# EAGLE design MB_DoorLock293 (EAGLE 9.5.2)
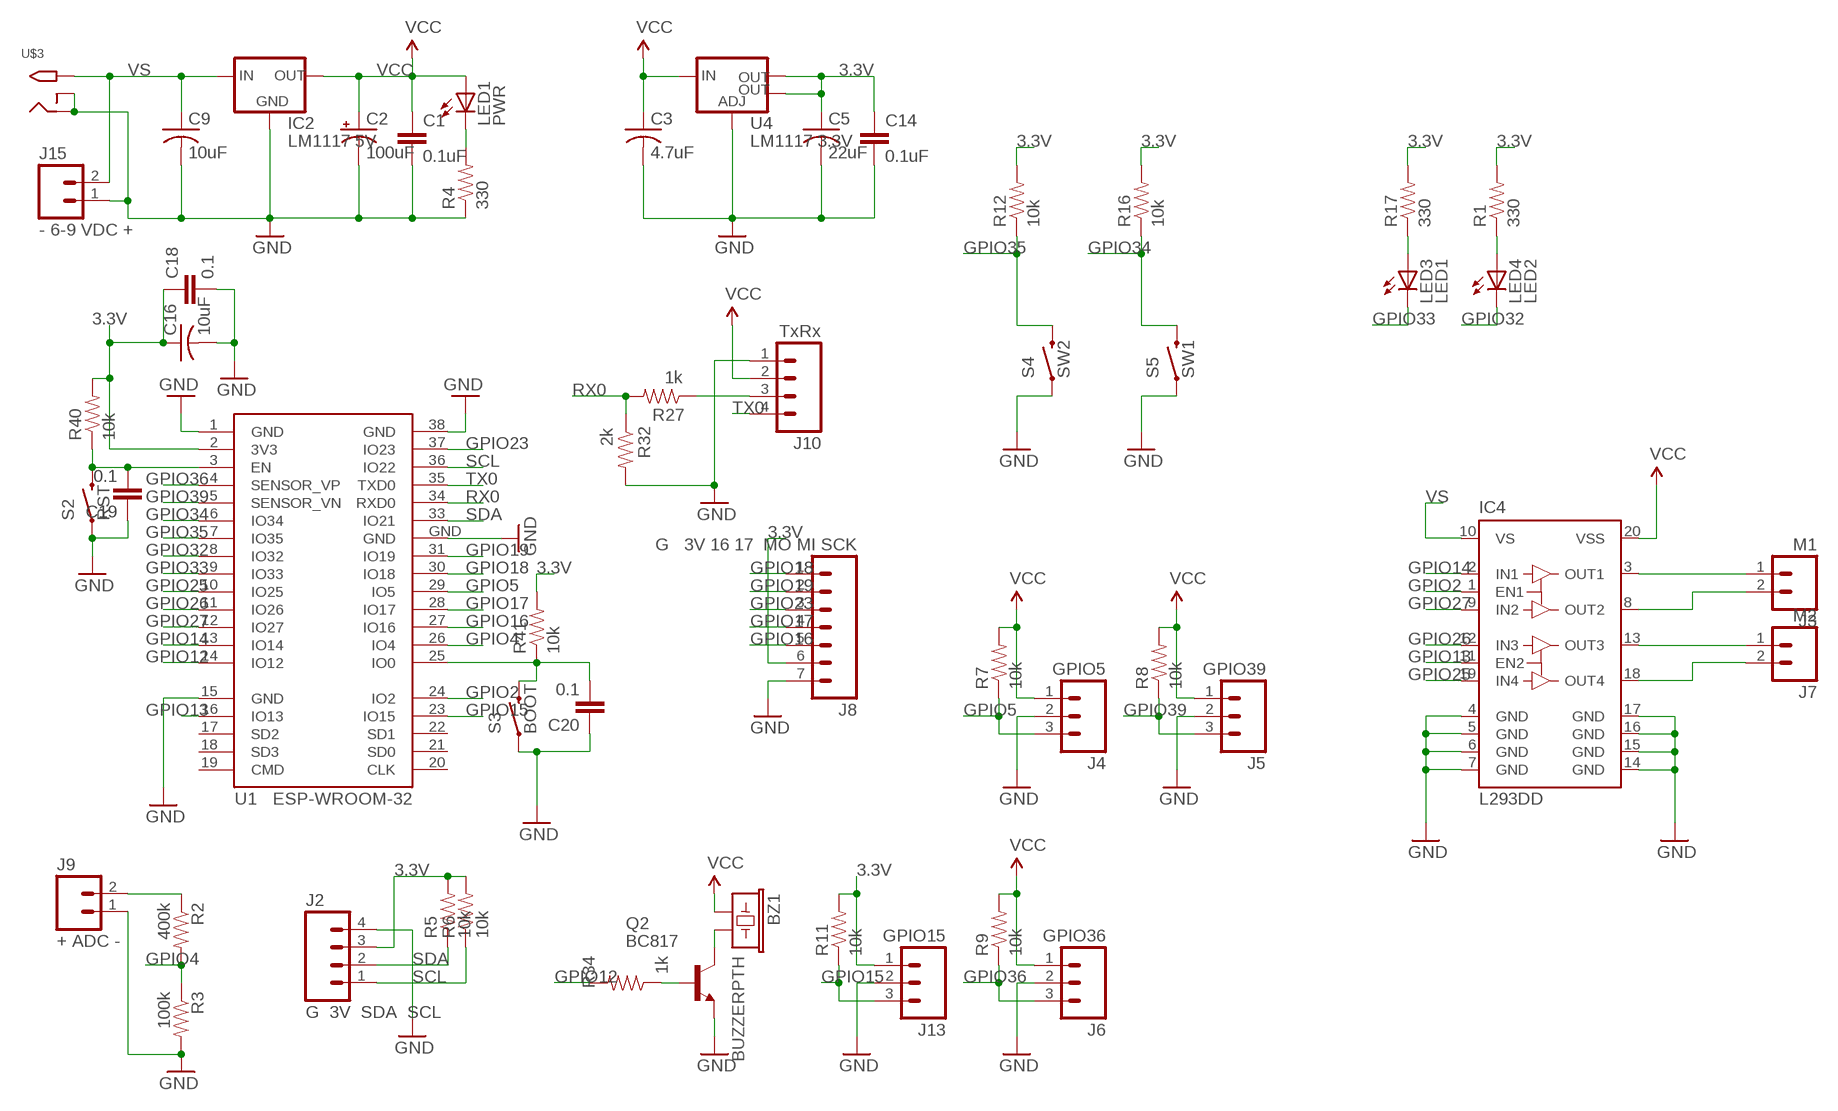
[diagram p0: schematic, sheet 1]

## Parts
BZ1  BUZZERPTH  [BUZZER-12MM]
C1  0.1uF  CAP0805  [0805]
C2  100uF  CAP_POL3528-KIT  [EIA3528-KIT]
C3  4.7uF  C-USC1206  [C1206]
C5  22uF  C-USC1206  [C1206]
C9  10uF  C-USC1206  [C1206]
C14  0.1uF  CAP0805  [0805]
C16  10uF  C-USC1206  [C1206]
C18  0.1  CAP0805  [0805]
C19  0.1  CAP0805  [0805]
C20  0.1  CAP0805  [0805]
IC2  LM1117 5V  LM1117DTX-3.3  [TO252]
IC4  L293DD  [SO20]
J2  G 3V SDA SCL  M04JST-PTH-VERT  [JST-4-PTH-VERT]
J3  M1  M02JST-PTH-VERT  [JST-2-PTH-VERT]
J4  GPIO5  M03JST-PTH-VERT  [JST-3-PTH-VERT]
J5  GPIO39  M03JST-PTH-VERT  [JST-3-PTH-VERT]
J6  GPIO36  M03JST-PTH-VERT  [JST-3-PTH-VERT]
J7  M2  M02JST-PTH-VERT  [JST-2-PTH-VERT]
J8  G 3V 16 17 MO MI SCK  M07  [1X07]
J9  + ADC -  M02JST-PTH-VERT  [JST-2-PTH-VERT]
J10  TxRx  M04POLAR  [MOLEX-1X4]
J13  GPIO15  M03JST-PTH-VERT  [JST-3-PTH-VERT]
J15  - 6-9 VDC +  M02JST-PTH-VERT  [JST-2-PTH-VERT]
LED1  PWR  LEDCHIP-LED0805  [CHIP-LED0805]
LED3  LED1  LEDCHIP-LED0805  [CHIP-LED0805]
LED4  LED2  LEDCHIP-LED0805  [CHIP-LED0805]
Q2  BC817  BC817-40LT1SMD  [SOT23-BEC]
R1  330  RESISTOR0805-RES  [0805]
R2  400k  RESISTOR0805-RES  [0805]
R3  100k  RESISTOR0805-RES  [0805]
R4  330  RESISTOR0805-RES  [0805]
R5  10k  RESISTOR0805-RES  [0805]
R6  10k  RESISTOR0805-RES  [0805]
R7  10k  RESISTOR0805-RES  [0805]
R8  10k  RESISTOR0805-RES  [0805]
R9  10k  RESISTOR0805-RES  [0805]
R11  10k  RESISTOR0805-RES  [0805]
R12  10k  RESISTOR0805-RES  [0805]
R16  10k  RESISTOR0805-RES  [0805]
R17  330  RESISTOR0805-RES  [0805]
R27  1k  RESISTOR0805-RES  [0805]
R32  2k  RESISTOR0805-RES  [0805]
R34  1k  RESISTOR0805-RES  [0805]
R40  10k  RESISTOR0805-RES  [0805]
R41  10k  RESISTOR0805-RES  [0805]
S2  RST  SWITCH-MOMENTARY-2SMD-1101NE  [TACTILE-SWITCH-1101NE]
S3  BOOT  SWITCH-MOMENTARY-2SMD-1101NE  [TACTILE-SWITCH-1101NE]
S4  SW2  SWITCH-MOMENTARY-2SMD-1101NE  [TACTILE-SWITCH-1101NE]
S5  SW1  SWITCH-MOMENTARY-2SMD-1101NE  [TACTILE-SWITCH-1101NE]
U1  ESP-WROOM-32  [ESP-WROOM-32]
U4  LM1117 3.3V  V_REG_LM1117SOT223  [SOT223]
U$3  7*12V  2.1MMJACK  [PJ-102A]

## Nets
3.3V: C5.1 C14.1 C16.1 C18.1 J2.3 J8.6 J13.1 R1.2 R5.2 R6.2 R11.2 R12.2 R16.2 R17.2 R40.2 R41.2 U1.2(3V3) U4.2(OUT) U4.4(OUT)
GND: C1.2 C2.C(-) C3.2 C5.2 C9.2 C14.2 C16.2 C18.2 C19.1 C20.1 IC2.1(GND) IC4.4(GND) IC4.5(GND) IC4.6(GND) IC4.7(GND) IC4.14(GND) IC4.15(GND) IC4.16(GND) IC4.17(GND) J2.4 J4.2 J5.2 J6.2 J8.7 J9.1 J10.1 J13.2 J15.1 Q2.E R3.2 R4.1 R32.2 S2.1 S3.1 S4.1 S5.1 U1.1(GND) U1.15(GND) U1.38(GND) U1.GND U4.1(ADJ) U$3.RING U$3.RING_SW
GPIO2: IC4.1(EN1) U1.24(IO2)
GPIO4: R2.2 R3.1 U1.26(IO4)
GPIO5: J4.3 R7.1 U1.29(IO5)
GPIO12: R34.2 U1.14(IO12)
GPIO13: IC4.11(EN2) U1.16(IO13)
GPIO14: IC4.2(IN1) U1.13(IO14)
GPIO15: J13.3 R11.1 U1.23(IO15)
GPIO16: J8.5 U1.27(IO16)
GPIO17: J8.4 U1.28(IO17)
GPIO18: J8.1 U1.30(IO18)
GPIO19: J8.2 U1.31(IO19)
GPIO23: J8.3 U1.37(IO23)
GPIO25: IC4.19(IN4) U1.10(IO25)
GPIO26: IC4.12(IN3) U1.11(IO26)
GPIO27: IC4.9(IN2) U1.12(IO27)
GPIO32: LED4.C U1.8(IO32)
GPIO33: LED3.C U1.9(IO33)
GPIO34: R16.1 S5.2 U1.6(IO34)
GPIO35: R12.1 S4.2 U1.7(IO35)
GPIO36: J6.3 R9.1 U1.4(SENSOR_VP)
GPIO39: J5.3 R8.1 U1.5(SENSOR_VN)
N$1: IC4.3(OUT1) J3.1
N$2: IC4.13(OUT3) J7.1
N$3: J9.2 R2.1
N$4: J10.3 R27.1
N$5: LED3.A R17.1
N$6: C20.2 R41.1 S3.2 U1.25(IO0)
N$9: LED1.C R4.2
N$11: LED4.A R1.1
N$14: IC4.8(OUT2) J3.2
N$16: C19.2 R40.1 S2.2 U1.3(EN)
N$17: IC4.18(OUT4) J7.2
N$29: Q2.B R34.1
N$40: BZ1.- Q2.C
RX0: R27.2 R32.1 U1.34(RXD0)
SCL: J2.1 R6.1 U1.36(IO22)
SDA: J2.2 R5.1 U1.33(IO21)
TX0: J10.4 U1.35(TXD0)
VCC: BZ1.+ C1.1 C2.A(+) C3.1 IC2.TAB(OUT) IC4.20(VSS) J4.1 J5.1 J6.1 J10.2 LED1.A R7.2 R8.2 R9.2 U4.3(IN)
VS: C9.1 IC2.2(IN) IC4.10(VS) J15.2 U$3.TIP
Unconnected: U1.17(SD2) U1.18(SD3) U1.19(CMD) U1.20(CLK) U1.21(SD0) U1.22(SD1)

## Library data of the parts
BZ1 = SparkFun-Electromechanical:BUZZER: Buzzer 12mm Spark Fun Electronics SKU : Comp-Buzzer
C1 C14 C18-C20 = SparkFun-Passives:CAP: Capacitor Standard 0603 ceramic capacitor, and 0.1" leaded capacitor.
C2 = SparkFun-Passives:CAP_POL: Capacitor Polarized These are standard SMD and PTH capacitors. Normally 10uF, 47uF, and 100uF in electrolytic and tantalum varieties. Always verify the external diameter of the through hole cap, it varies with capacity, voltage, and manufacturer. The EIA devices should be standard.
C3 C5 C9 C16 = adafruit:C-US: CAPACITOR, American symbol
IC2 = lm1117:LM1117DTX-*
IC4 = st-microelectronics:L293DD: PUSH-PULL FOUR CHANNEL DRIVER WITH DIODES Source: http://www.st.com/stonline/books/pdf/docs/1330.pdf; OC_FARNELL: unknown
J2 = SparkFun-Connectors:M04: Header 4 Standard 4-pin 0.1" header. Use with straight break away headers (SKU : PRT-00116), right angle break away headers (PRT-00553), swiss pins (PRT-00743), machine pins (PRT-00117), and female headers (PRT-00115). Molex polarized connector foot print use with SKU : PRT-08231 with associated crimp pins and housings. 1MM SMD Version SKU: PRT-10208; PROD_ID: CONN-13251
J3 J7 J9 J15 = SparkFun-Connectors:M02: Standard 2-pin 0.1" header. Use with - straight break away headers ( PRT-00116) - right angle break away headers (PRT-00553) - swiss pins (PRT-00743) - machine pins (PRT-00117) - female headers (PRT-00115) Molex polarized connector foot print use with: PRT-08233 with associated crimp pins and housings. 2.54_SCREWTERM for use with PRT-10571. 3.5mm Screw Terminal footprints for PRT-08084 5mm Screw Terminal footprints for use with PRT-08432
J4-J6 J13 = ES-CONNECTOR:M03: Header 3 Standard 3-pin 0.1" header. Use with straight break away headers (SKU : PRT-00116), right angle break away headers (PRT-00553), swiss pins (PRT-00743), machine pins (PRT-00117), and female headers (PRT-00115). Molex polarized connector foot print use with SKU : PRT-08232 with associated crimp pins and housings.
J8 = SparkFun-Connectors:M07: Header 7 Standard 7-pin 0.1" header. Use with straight break away headers (SKU : PRT-00116), right angle break away headers (PRT-00553), swiss pins (PRT-00743), machine pins (PRT-00117), and female headers (PRT-00115). NOTES ON THE VARIANTS LOCK and LOCK_LONGPADS... This footprint was designed to help hold the alignment of a through-hole component (i.e. 7-pin header) while soldering it into place. You may notice that each hole has been shifted either up or down by 0.005 of an inch from it's more standard position (which is usually a perfectly straight line). This slight alteration caused the pins (the squares in the middle) to touch the edges of the holes. Because they are alternating, it causes a "brace" to hold the header in place. 0.005 has proven to be the perfect amount of "off-center" position when using our standard breakaway headers. Although looks a little odd when you look at the bare footprint, once you have a header in there, the alteration is very hard to notice. Also, if you push a header all the way into place, it is covered up entirely on the bottom side. This idea of altering the position of holes to aid alignment will be further integrated into the Sparkfun Library for other footprints. It can help hold any component with 3 or more connection pins.
J10 = SparkFun-Connectors:M04: Header 4 Standard 4-pin 0.1" header. Use with straight break away headers (SKU : PRT-00116), right angle break away headers (PRT-00553), swiss pins (PRT-00743), machine pins (PRT-00117), and female headers (PRT-00115). Molex polarized connector foot print use with SKU : PRT-08231 with associated crimp pins and housings. 1MM SMD Version SKU: PRT-10208
LED1 LED3 LED4 = adafruit:LED: LED OSRAM: - CHIPLED LG R971, LG N971, LY N971, LG Q971, LY Q971, LO R971, LY R971 LH N974, LH R974 LS Q976, LO Q976, LY Q976 LO Q996 - Hyper CHIPLED LW Q18S LB Q993, LB Q99A, LB R99A - SideLED LS A670, LO A670, LY A670, LG A670, LP A670 LB A673, LV A673, LT A673, LW A673 LH A674 LY A675 LS A676, LA A676, LO A676, LY A676, LW A676 LS A679, LY A679, LG A679 - Hyper Micro SIDELED® LS Y876, LA Y876, LO Y876, LY Y876 LT Y87S - SmartLED LW L88C, LW L88S LB L89C, LB L89S, LG L890 LS L89K, LO L89K, LY L89K LS L896, LA L896, LO L896, LY L896 - TOPLED LS T670, LO T670, LY T670, LG T670, LP T670 LSG T670, LSP T670, LSY T670, LOP T670, LYG T670 LG T671, LOG T671, LSG T671 LB T673, LV T673, LT T673, LW T673 LH T674 LS T676, LA T676, LO T676, LY T676, LB T676, LH T676, LSB T676, LW T676 LB T67C, LV T67C, LT T67C, LS T67K, LO T67K, LY T67K, LW E67C LS E67B, LA E67B, LO E67B, LY E67B, LB E67C, LV E67C, LT E67C LW T67C LS T679, LY T679, LG T679 LS T770, LO T770, LY T770, LG T770, LP T770 LB T773, LV T773, LT T773, LW T773 LH T774 LS E675, LA E675, LY E675, LS T675 LS T776, LA T776, LO T776, LY T776, LB T776 LHGB T686 LT T68C, LB T68C - Hyper Mini TOPLED® LB M676 - Mini TOPLED Santana® LG M470 LS M47K, LO M47K, LY M47K Source: http://www.osram.convergy.de/
Q2 = transistor-npn:BC817*: NPN Transistor
R1-R9 R11 R12 R16 R17 R27 R32 R34 R40 R41 = SparkFun-Resistors:RESISTOR: Resistor Basic schematic elements and footprints for 0603, 1206, and PTH resistors.
S2-S5 = SparkFun-Electromechanical:SWITCH-MOMENTARY-2: Various NO switches- pushbuttons, reed, etc; PROD_ID: SWCH-00815
U1 = esp32:ESP-WROOM-32: Espressif Systems ESP-WROOM-32
U4 = SparkFun-PowerIC:V_REG_LM1117: Voltage Regulator LM1117 Standard adjustable voltage regulator but in SMD form. Spark Fun Electronics SKU : COM-00595; PROD_ID: VREG-08170
U$3 = adafruit:2.1MMJACK: 2.1mm x 5.5mm DC jack with internal switch. Digikey part #PJ-102A, 4UCON part #05537 By microbuilder.eu

## Board
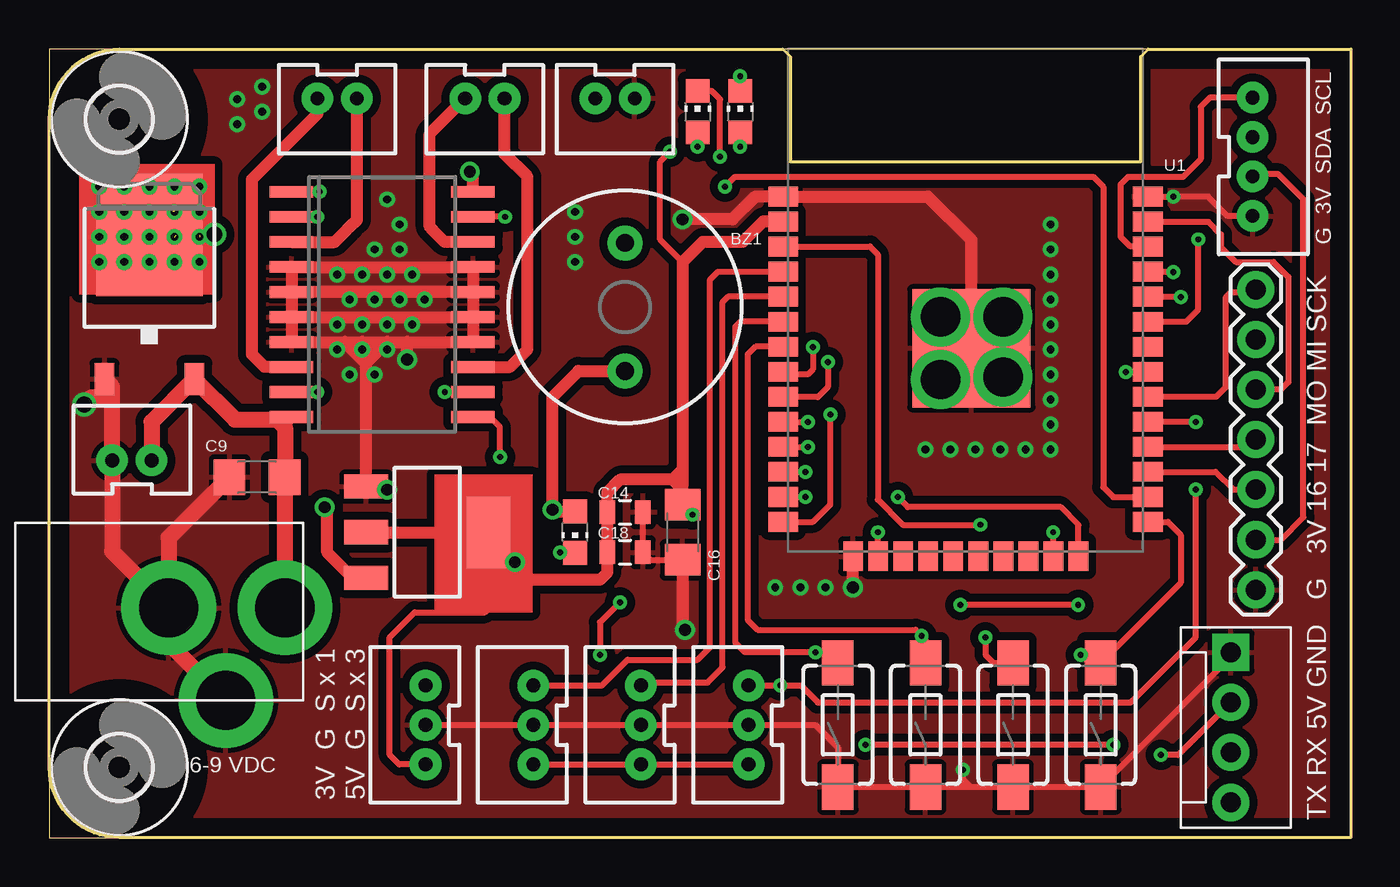
[diagram p1: board, top side]
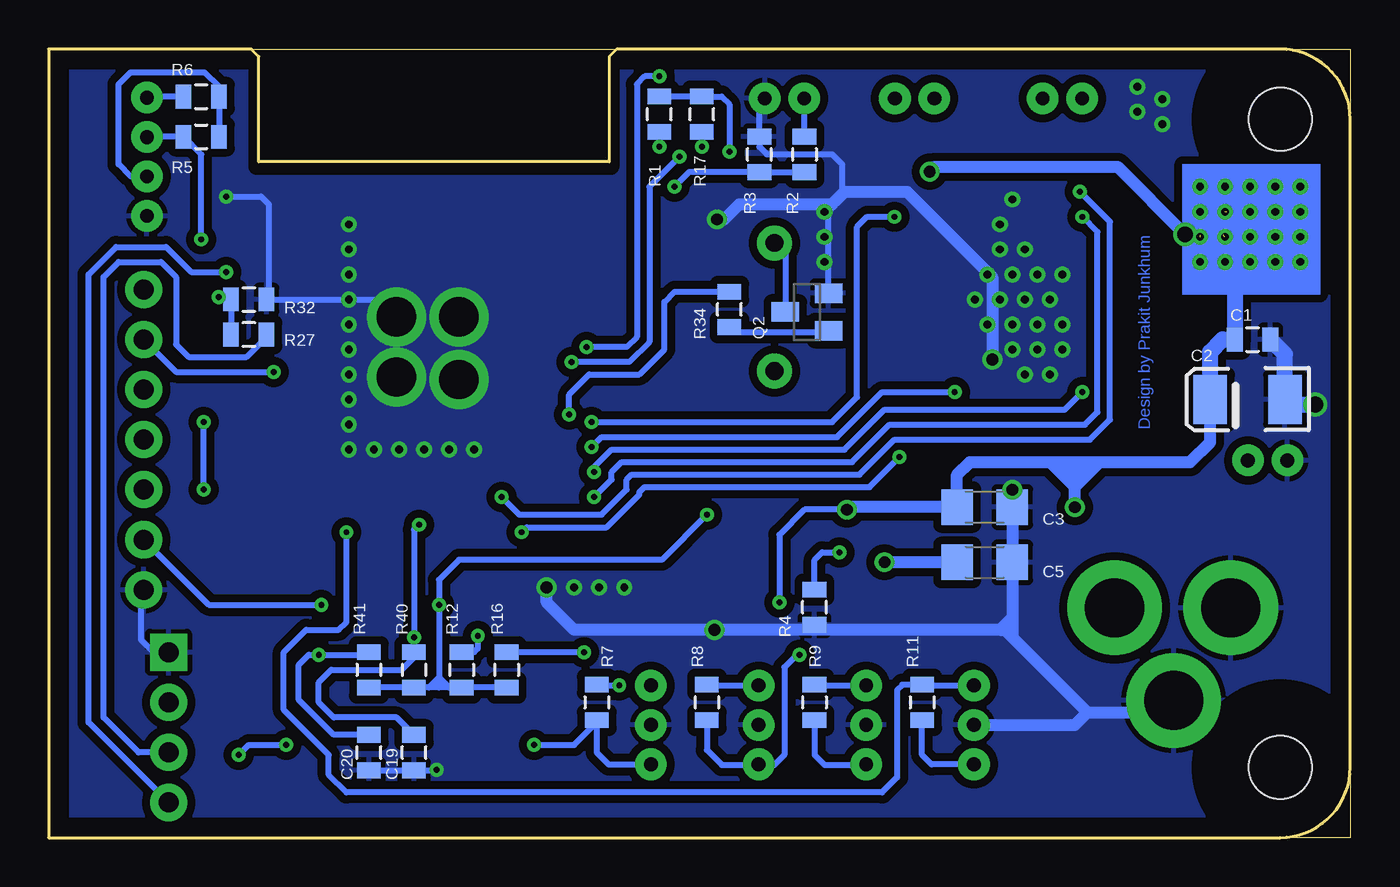
[diagram p2: board, bottom side, seen from below]

Size 66 x 40 mm. Coordinates in mm from the lower left corner, seen from the top.
Outline: 0,0 66,0 66,40 0,40 0,0
Copper layers (1*16): Top 0.035mm / dielectric 1.5mm / Bottom 0.035mm
Design rules "default *": minimum track width 6mil, minimum drill 0.35mm, track to track 6mil, track to pad 6mil, pad to pad 6mil, via to via 6mil, smd to smd 6mil, copper to edge 40mil, drill to drill 6mil, minimum pad ring 10mil, minimum via ring 8mil, stop-mask expansion 4mil, vias tented up to drill 25mil, thermal gap 10mil
Milling: 12 lines

### Footprints (pad centres in the part's own frame; a part is rotated, then mirrored left to right if it is on the bottom)
BUZZER-12MM = drill 0.9 pad 1.778: + 3.25,0; - -3.25,0
0805 = smd 0.8 x 1.2: 1 -0.9,0; 2 0.9,0
EIA3528-KIT = smd 1.7 x 2.5: A 1.9,0; C -1.9,0
C1206 = smd 1.6 x 1.8: 1 -1.4,0; 2 1.4,0
TO252 = smd 1 x 1.6: 1 -2.28,-4.8; 2 2.28,-4.8 | smd 5.4 x 6.2: TAB 0,2.5
SO20 = smd 0.6 x 2.2: 1 -5.715,-4.6; 2 -4.445,-4.6; 3 -3.175,-4.6; 4 -1.905,-4.6; 5 -0.635,-4.6; 6 0.635,-4.6; 7 1.905,-4.6; 8 3.175,-4.6; 9 4.445,-4.6; 10 5.715,-4.6; 11 5.715,4.6; 12 4.445,4.6; 13 3.175,4.6; 14 1.905,4.6; 15 0.635,4.6; 16 -0.635,4.6; 17 -1.905,4.6; 18 -3.175,4.6; 19 -4.445,4.6; 20 -5.715,4.6
JST-4-PTH-VERT = drill 0.7 pad 1.6: 1 -3,-0.55; 2 -1,-0.55; 3 1,-0.55; 4 3,-0.55
JST-2-PTH-VERT = drill 0.7 pad 1.6: 1 -1,-0.55; 2 1,-0.55
JST-3-PTH-VERT = drill 0.7 pad 1.6: 1 -2,-0.55; 2 0,-0.55; 3 2,-0.55
1X07 = drill 1.016 pad 1.88: 1 0,0; 2 2.54,0; 3 5.08,0; 4 7.62,0; 5 10.16,0; 6 12.7,0; 7 15.24,0
MOLEX-1X4 = drill 1.016 pad 1.88 square: 1 0,0 | drill 1.016 pad 1.88: 2 2.54,0; 3 5.08,0; 4 7.62,0
CHIP-LED0805 = smd 1.2 x 1.2: A 0,-1.05; C 0,1.05
SOT23-BEC = smd 1 x 1.4: B -0.95,-1.1; C 0,1.1; E 0.95,-1.1
TACTILE-SWITCH-1101NE = smd 2.3 x 1.6: 1 -3.15,0; 2 3.15,0
ESP-WROOM-32 = smd 1.5 x 1: 1 -9.25,7; 2 -9.25,5.73; 3 -9.25,4.46; 4 -9.25,3.19; 5 -9.25,1.92; 6 -9.25,0.65; 7 -9.25,-0.62; 8 -9.25,-1.89; 9 -9.25,-3.16; 10 -9.25,-4.43; 11 -9.25,-5.7; 12 -9.25,-6.97; 13 -9.25,-8.24; 14 -9.25,-9.51; 25 9.25,-9.51; 26 9.25,-8.24; 27 9.25,-6.97; 28 9.25,-5.7; 29 9.25,-4.43; 30 9.25,-3.16; 31 9.25,-1.89; 32 9.25,-0.62; 33 9.25,0.65; 34 9.25,1.92; 35 9.25,3.19; 36 9.25,4.46; 37 9.25,5.73; 38 9.25,7 | smd 1 x 1.5: 15 -5.7,-11.25; 16 -4.43,-11.25; 17 -3.16,-11.25; 18 -1.89,-11.25; 19 -0.62,-11.25; 20 0.65,-11.25; 21 1.92,-11.25; 22 3.19,-11.25; 23 4.46,-11.25; 24 5.73,-11.25 | smd 6 x 6: GND 0.3,-0.7
SOT223 = smd 1.219 x 2.235: 1 -2.311,-3.099; 2 0,-3.099; 3 2.311,-3.099 | smd 3.6 x 2.2: 4 0,3.099
3,2 = hole 3.2: 0,0
PJ-102A = drill 3 pad 4.8: RING 0.1,-3.39; RING_SW -4.6,-6.29; TIP 0.1,-9.29

### Placement (x,y rotation side)
BZ1  29.21,26.92 270 top
C1  4.95,25.27 0 bottom
C2  5.21,22.23 180 bottom
C3  18.54,16.76 0 bottom
C5  18.54,13.97 0 bottom
C9  10.54,18.29 180 top
C14  29.21,16.51 0 top
C16  32.13,15.49 270 top
C18  29.21,14.48 0 top
C19  47.5,4.32 90 bottom
C20  49.78,4.32 90 bottom
IC2  5.08,28.07 0 top
IC4  16.89,27.05 270 top
J2  61.59,34.54 270 top
J3  14.61,36.96 180 top
J4  34.92,5.71 90 top
J5  29.46,5.71 90 top
J6  24,5.71 90 top
J7  22.1,36.96 180 top
J8  61.21,27.81 270 top
J9  28.7,36.96 180 top
J10  59.94,9.4 270 top
J13  18.54,5.71 90 top
J15  4.19,19.68 0 top
LED1  26.67,15.49 180 top
LED3  32.89,36.83 0 top
LED4  35.05,36.83 0 top
Q2  27.56,26.67 90 bottom
R1  35.05,36.7 90 bottom
R2  27.69,34.67 270 bottom
R3  29.97,34.67 90 bottom
R4  27.18,11.68 90 bottom
R5  58.29,35.56 0 bottom
R6  58.29,37.59 0 bottom
R7  38.23,6.86 270 bottom
R8  32.64,6.86 270 bottom
R9  27.18,6.86 270 bottom
R11  21.72,6.86 270 bottom
R12  45.09,8.51 270 bottom
R16  42.8,8.51 270 bottom
R17  32.89,36.7 90 bottom
R27  55.88,25.53 180 bottom
R32  55.88,27.3 0 bottom
R34  31.5,26.8 90 bottom
R40  47.5,8.51 270 bottom
R41  49.78,8.51 270 bottom
S2  48.9,5.71 90 top
S3  53.34,5.71 90 top
S4  44.45,5.71 90 top
S5  40.01,5.71 90 top
U1  46.48,25.53 0 top
U4  19.18,15.49 270 top
U$1  [3,2]  3.56,3.56 0 top
U$2  [3,2]  3.56,36.45 0 top
U$3  2.67,11.56 90 top

### Tracks (layer width: path | path; a pad name or v marks a point on that pad's centre or on a via)
3.3V  (via drill 0.3, 0.6)
  Top 0.305: C14.1 C18.1 | 32.13,29.21 30.99,30.35 30.99,34.29 v31.5,34.8 | J13.1 17.75,3.71 17.27,4.19 17.27,10.16 18.54,11.43 22.1,11.43 22.73,12.06 22.73,13.08 | J8.6 62.48,15.11 63.63,16.26 63.63,32.38 62.36,33.66 61.16,33.66 J2.3 | C16.1 v32.64,16.38 | v52.2,11.81 v46.23,11.81
  Top 0.61: U4.2 21.97,15.49 | 21.97,15.49 U4.4 | U4.4 22.95,14.82 22.86,14.73 22.86,13.34 | 32.13,17.65 C16.1 32.13,17.91 | 31.62,18.16 28.96,18.16 28.31,17.52 C14.1 28.31,13.47 28.32,13.46 27.94,13.08 23.75,13.08 | 32.13,18.67 32.13,29.21 33.15,30.23 35.18,30.23 36.21,31.26 U1.2 | 32.13,18.67 32.13,17.91 | 31.62,18.16 32.13,18.67 | 31.62,18.16 31.88,17.91 32.13,17.91 | 23.75,13.08 23.5,13.08 | 23.5,13.08 22.73,13.08 21.97,13.84 21.97,15.49 | v23.62,13.97 23.5,13.84 23.5,13.08 | U4.4 22.28,14.55 23.75,13.08
  Bottom 0.305: R16.2 R12.2 45.72,7.61 | 45.72,7.61 46.23,7.61 | 46.23,7.61 46.74,7.61 | 46.74,7.61 R40.2 R41.2 | R1.2 R17.2 31.89,37.6 31.5,37.21 v31.5,34.8 | R5.2 R6.2 57.39,38.09 58.14,38.83 61.88,38.83 62.48,38.23 62.48,34.16 61.87,33.54 J2.3 | J13.1 21.24,3.71 21.72,4.19 R11.2 | v32.64,16.38 34.92,14.1 45.21,14.1 46.23,13.08 v46.23,11.81 46.23,8.12 | 46.23,8.12 46.23,7.61 | 45.72,7.61 46.23,8.12 | 46.23,8.12 46.74,7.61 | J8.6 57.91,11.81 v52.2,11.81
  Bottom 0.61: C5.1 v23.62,13.97
GND  (via drill 0.3, 0.4, 0.6, 0.8, 2)
  Top 0.305: J13.2 J6.2 J5.2 J4.2 38.86,5.71 40.01,4.57 S5.1 S4.1 45.97,2.56 | 45.97,2.56 46.23,2.56 | 46.23,2.56 46.74,2.56 | 46.74,2.56 S2.1 S3.1 59.94,9.17 J10.1 | C14.2 C18.2 30.49,14.09 C16.2 | J2.4 59.77,31.54 58.79,32.53 v57.02,32.53 U1.38 | 46.23,2.56 46.35,2.69 v46.35,3.43 46.35,2.95 | 46.35,2.95 45.97,2.56 | 46.35,2.95 46.74,2.56
  Top 0.61: IC4.5 IC4.4 IC4.17 IC4.16 | IC4.5 IC4.6 | IC4.6 IC4.7 14.99,25.15 | IC4.16 IC4.15 | IC4.15 IC4.14 18.16,25.15 | 14.99,25.15 15.88,25.15 | 15.88,25.15 17.14,25.15 | 17.14,25.15 18.16,25.15 | IC4.6 IC4.15 | IC4.16 IC4.5 | 16.08,24.05 U4.1 16.23,17.65 v17.14,17.65 | 16.08,24.05 16.08,24.08 | 16.08,24.08 16.08,24.94 15.88,25.15 | 17.14,25.15 16.08,24.08 | 16.08,24.05 14.99,25.15 | v40.77,12.7 40.78,12.71 U1.15 | C16.2 32.13,10.67 v32.26,10.54 | U1.GND 45.21,26.4 v45.21,26.42 | v48.39,26.42 v48.39,23.37 48.24,23.37 U1.GND | v45.21,23.24 46.78,24.81 U1.GND | U1.GND 46.78,30.31 44.56,32.53 U1.1 35.83,32.53 34.67,31.37 v32.13,31.37 | v18.16,24.26 18.16,25.15
  Top 0.813: U$3.RING 6.06,9.86 U$3.RING_SW | 3.19,22.35 J15.1 3.19,14.52 U$3.RING | 3.19,22.35 3.19,22.88 IC2.1 | C9.2 6.06,15.2 U$3.RING | v1.78,21.97 2.16,22.35 3.19,22.35
  Bottom 0.305: C20.1 C19.1 46.37,3.42 v46.35,3.43 | J10.1 60.71,9.4 61.34,10.03 61.34,12.45 J8.7 | J9.1 29.97,37.24 R3.2 29.97,35.05 29.59,34.67 26.29,34.67 25.78,34.16 25.78,32.64 | 17.14,10.67 17.14,10.54 | Q2.E 26.46,31.54 | 26.46,31.54 26.46,31.75 | 26.46,31.75 26.46,31.96 26.29,32.13 | 26.46,31.54 27.05,32.13 | 25.65,32.77 25.65,32.55 26.46,31.75 | v48.39,26.42 49.28,27.3 R32.2 54.86,27.42 54.86,32.13 55.26,32.53 v57.02,32.53
  Bottom 0.61: 17.14,11.18 C5.2 C3.2 v17.14,17.65 | 17.14,11.18 17.14,10.54 | 17.14,10.54 17.14,10.16 | 17.14,10.16 13.34,6.35 | 13.34,6.35 9.56,6.35 U$3.RING_SW | J13.2 13.97,5.71 13.34,6.35 | 17.14,10.54 17.53,10.54 | 17.78,10.54 27.18,10.54 | 27.18,10.54 v32.26,10.54 39.37,10.54 40.77,11.94 v40.77,12.7 | R4.1 27.18,10.54 | 17.78,10.54 17.14,11.18 | 17.78,10.54 17.53,10.54 | 17.53,10.54 17.14,10.16 | v32.13,31.37 31.75,31.37 30.99,32.13 27.05,32.13 26.29,32.13 25.78,32.64 25.65,32.77 22.48,32.77 18.16,28.45 v18.16,24.26
  Bottom 0.813: C1.2 3.31,24.53 C2.C 3.05,21.97 v1.78,21.97
  other vias: 14.61,28.57 15.88,28.57 17.14,28.57 18.41,28.57 19.05,27.3 17.78,27.3 16.51,27.3 15.24,27.3 14.61,26.04 15.88,26.04 17.14,26.04 18.41,26.04 17.14,24.77 15.88,24.77 14.61,24.77 15.24,23.5 16.51,23.5 16.51,29.84 17.78,29.84 17.78,31.11 17.14,32.38 10.79,38.1 10.79,36.83 9.53,36.2 9.53,37.47 44.45,19.68 45.72,19.68 46.99,19.68 48.26,19.68 49.53,19.68 50.8,19.68 50.8,20.95 50.8,22.23 50.8,23.5 50.8,24.77 50.8,26.04 50.8,27.3 50.8,28.57 50.8,29.84 50.8,31.11 36.83,12.7 38.1,12.7 39.37,12.7 26.67,31.75 26.67,30.48 26.67,29.21
  pour Bottom (isolate 0.406): 0.13,40.01 66.04,40.01 66.04,-0.13 0.13,-0.13
  pour Top (isolate 0.406): 0,40.01 66.04,40.01 66.04,0 0,0
GPIO2  (via drill 0.3)
  Top 0.305: U1.24 52.21,15.86 51.31,16.76 43.56,16.76 v43.05,17.27 | v13.72,32.77 IC4.1
  Bottom 0.305: v43.05,17.27 42.16,16.38 37.97,16.38 36.7,17.65 36.7,18.16 36.45,18.41 33.02,18.41 32.26,18.41 24.89,18.41 23.11,20.19 13.21,20.19 12.19,21.21 12.19,31.24 v13.72,32.77
GPIO4  (via drill 0.3)
  Top 0.305: U1.26 53.99,17.29 53.98,17.27 53.47,17.78 53.47,33.02 52.96,33.53 34.8,33.53 v34.29,33.02
  Bottom 0.305: R2.2 R3.1 33.54,33.77 v34.29,33.02
GPIO5  (via drill 0.3)
  Top 0.305: J4.3 v37.08,7.71 38.13,7.71 38.99,6.86 54.86,6.86 58.17,10.16 v58.17,17.65 | v58.17,21.08 58.15,21.1 U1.29
  Bottom 0.305: v58.17,17.65 v58.17,21.08 | R7.1 38.18,7.71 v37.08,7.71
GPIO12  (via drill 0.3)
  Top 0.305: U1.14 38.75,16.02 39.62,16.89 v39.62,21.46
  Bottom 0.305: v39.62,21.46 39.62,22.48 38.61,23.5 36.07,23.5 34.8,24.77 34.8,27.18 34.28,27.7 R34.2
GPIO13  (via drill 0.3)
  Top 0.305: U1.16 42.05,15.48 v42.04,15.49 | v22.86,19.3 22.86,20.83 22.35,21.34 IC4.11
  Bottom 0.305: v42.04,15.49 41.78,15.75 37.72,15.75 36.07,17.4 36.07,17.53 35.81,17.78 24.38,17.78 v22.86,19.3
GPIO14  (via drill 0.3)
  Top 0.305: U1.13 38.34,17.29 v38.35,17.27 | v13.59,31.5 IC4.2
  Bottom 0.305: v38.35,17.27 37.47,18.16 37.47,18.54 36.96,19.05 25.27,19.05 23.37,20.95 15.24,20.95 14.61,20.95 13.46,20.95 12.83,21.59 12.83,30.73 v13.59,31.5
GPIO15  (via drill 0.3)
  Top 0.305: v50.93,15.49 50.93,14.29 U1.23
  Bottom 0.305: J13.3 21.67,7.71 R11.1 22.72,7.76 22.99,7.49 22.99,3.05 23.75,2.29 50.93,2.29 51.82,3.17 51.82,4.19 54.1,6.48 54.1,9.4 52.96,10.54 51.31,10.54 50.93,10.92 v50.93,15.49
GPIO16
  Top 0.305: U1.27 59.17,18.56 60.07,17.65 J8.5
GPIO17
  Top 0.305: U1.28 60.85,19.83 J8.4
GPIO18
  Top 0.305: U1.30 59.2,22.37 59.69,22.86 59.69,27.43 59.94,27.69 61.09,27.69 J8.1
GPIO19  (via drill 0.3)
  Top 0.305: v54.61,23.62 55.72,23.62 U1.31
  Bottom 0.305: J8.2 59.56,23.62 v54.61,23.62
GPIO23
  Top 0.305: U1.37 55.75,31.24 58.8,31.24 59.44,30.61 59.44,29.97 60.2,29.21 62.1,29.21 62.87,28.45 62.87,23.11 62.48,22.73 J8.3
GPIO25  (via drill 0.3)
  Top 0.305: U1.10 38.47,21.1 v38.48,21.08 | v23.11,31.5 IC4.19
  Bottom 0.305: v38.48,21.08 26.29,21.08 25.02,22.35 25.02,30.99 24.51,31.5 v23.11,31.5
GPIO26  (via drill 0.3)
  Top 0.305: U1.11 38.47,19.83 v38.48,19.81 | v20.07,22.61 IC4.12
  Bottom 0.305: v38.48,19.81 37.97,20.32 26.04,20.32 23.75,22.61 v20.07,22.61
GPIO27  (via drill 0.3)
  Top 0.305: U1.12 38.34,18.56 v38.35,18.54 | v13.59,22.61 IC4.9
  Bottom 0.305: v38.35,18.54 38.35,18.8 37.47,19.68 25.65,19.68 23.62,21.72 14.48,21.72 v13.59,22.61
GPIO32  (via drill 0.3)
  Top 0.305: LED4.C v35.05,38.63 | v38.73,24.89 38.73,23.75 38.48,23.5 37.37,23.5 U1.8
  Bottom 0.305: v35.05,38.63 35.79,38.63 36.2,38.23 36.2,25.4 36.7,24.89 v38.73,24.89
GPIO33  (via drill 0.3)
  Top 0.305: LED3.C 33.62,37.88 34.04,37.47 v34.04,34.54 | v39.5,24.13 39.5,22.86 38.99,22.35 37.25,22.35 U1.9
  Bottom 0.305: v34.04,34.54 35.56,33.02 35.56,25.15 36.58,24.13 v39.5,24.13
GPIO34  (via drill 0.3)
  Top 0.305: U1.6 35.07,26.18 34.8,25.91 34.8,9.91 35.31,9.4 v38.86,9.4 39.47,9.4 S5.2
  Bottom 0.305: R16.1 38.87,9.41 v38.86,9.4
GPIO35  (via drill 0.3)
  Top 0.305: U1.7 35.83,24.91 35.43,24.51 35.43,22.86 35.43,11.05 35.94,10.54 43.94,10.54 v44.26,10.22 44.45,10.03 S4.2
  Bottom 0.305: v44.26,10.22 44.26,9.59 44.44,9.41 R12.1
GPIO36
  Top 0.305: 24.64,7.8 J6.3 28.04,7.71 29.34,9.02 32.89,9.02 33.53,9.65 33.53,28.32 33.92,28.72 U1.4
  Bottom 0.305: R9.1 27.14,7.71 J6.3
GPIO39
  Top 0.305: U1.5 34.43,27.45 34.16,27.18 34.16,8.64 33.4,7.87 30.17,7.87 J5.3 30.1,7.8
  Bottom 0.305: R8.1 32.6,7.71 J5.3
N$1
  Top 0.61: IC4.3 14.48,30.23 14.99,30.73 15.24,30.99 15.61,31.35 J3.1
N$2
  Top 0.61: IC4.13 23.37,23.88 24.26,24.77 24.26,33.53 23.1,34.69 J7.1
N$3
  Bottom 0.305: R2.1 27.69,37.49 J9.2
N$4
  Bottom 0.305: J10.3 61.47,4.32 63.25,6.1 63.25,28.45 62.48,29.21 60.33,29.21 59.56,28.45 59.56,25.02 58.93,24.38 56,24.38 54.98,25.4 R27.1
N$5  (via drill 0.3)
  Top 0.305: LED3.A v32.89,35.05
  Bottom 0.305: v32.89,35.05 R17.1
N$6  (via drill 0.3)
  Top 0.305: 55.75,16 U1.25 56.75,16.02 57.4,15.37 57.4,12.93 S3.2 52.73,8.87 v52.32,9.27
  Bottom 0.305: C20.2 51.57,5.22 53.34,6.99 53.34,8.76 52.83,9.27 v52.32,9.27 49.92,9.27 R41.1
N$9  (via drill 0.3)
  Top 0.305: v25.91,14.48 25.94,14.44 LED1.C
  Bottom 0.305: R4.2 27.18,14.1 26.8,14.48 v25.91,14.48
N$11  (via drill 0.3)
  Top 0.305: v35.05,35.05 LED4.A
  Bottom 0.305: R1.1 v35.05,35.05
N$14
  Top 0.61: IC4.8 10.92,23.88 10.29,24.51 10.29,33.4 13.61,36.72 J3.2
N$16  (via drill 0.3)
  Top 0.305: S2.2 47.9,8.87 47.5,9.27 v47.5,10.16 | U1.3 41.64,29.99 42.04,29.59 42.04,17.14 43.31,15.88 v47.24,15.88
  Bottom 0.305: C19.2 48.38,6.1 51.56,6.1 52.32,6.86 52.32,7.87 51.69,8.51 48.13,8.51 47.5,9.14 R40.1 v47.5,10.16 47.5,15.62 v47.24,15.88
N$17
  Top 0.61: IC4.18 20.07,30.23 19.43,30.86 19.3,30.99 19.3,35.71 J7.2
N$29
  Bottom 0.305: R34.1 31.25,25.65 26.52,25.65 Q2.B
N$40
  Bottom 0.305: BZ1.- 28.66,29.62 Q2.C
RX0  (via drill 0.3)
  Top 0.305: v57.4,27.43 55.75,27.43 U1.34
  Bottom 0.305: R27.2 R32.1 57.28,27.3 v57.4,27.43
SCL
  Top 0.305: U1.36 54.85,29.99 54.36,30.48 54.36,33.15 54.74,33.53 57.53,33.53 58.42,34.42 58.42,37.08 58.88,37.54 J2.1
  Bottom 0.305: R6.1 61,37.59 J2.1
SDA  (via drill 0.3)
  Top 0.305: U1.33 57.67,26.18 58.29,26.8 v58.29,30.35
  Bottom 0.305: J2.2 61.03,35.56 R5.1 58.29,34.66 v58.29,30.35
TX0  (via drill 0.3)
  Top 0.305: v57.02,28.7 55.75,28.7 U1.35
  Bottom 0.305: J10.4 64.01,5.84 64.01,28.57 62.61,29.97 60.07,29.97 58.8,28.7 v57.02,28.7
VCC  (via drill 0.3, 0.4, 0.6, 0.8)  (3 unrouted)
  Top 0.305: J6.1 J5.1 J4.1 | J10.2 57.28,4.19 v56.39,4.19 | v53.98,4.7 v41.4,4.7 | v28.96,11.94 27.94,10.92 v27.94,9.27 | IC2.TAB v5.08,31.75 v6.35,33.02 | IC2.TAB 7.53,33.02 v7.62,33.02 | IC2.TAB 4.99,30.57 v3.81,31.75 | IC2.TAB 3.72,30.57 v2.54,31.75 3.9,31.75 IC2.TAB | IC2.TAB 2.63,30.57 v2.54,30.48 | IC2.TAB 3.9,30.57 v3.81,30.48 | 6.26,30.57 6.99,29.84 | 6.99,29.84 v7.62,29.21 6.99,29.84 | 5.8,29.84 6.35,29.3 v6.35,29.21 | IC2.TAB v5.08,30.48 v3.81,29.21 | IC2.TAB 3.72,29.21 v2.54,29.21 | IC2.TAB 3.81,31.84 v3.81,33.02 | IC2.TAB 2.63,33.02 v2.54,33.02 | 5.8,29.84 6.99,29.84 | IC2.TAB v5.08,33.02 | IC2.TAB 6.44,30.57 v7.62,31.75 6.26,31.75 IC2.TAB | IC2.TAB 5.8,29.84 | IC2.TAB v5.08,29.21 | IC2.TAB 7.62,30.57
  Top 0.61: U4.3 15.39,13.18 14.1,14.48 14.1,16.64 v13.97,16.76 | LED1.A 25.62,16.54 v25.53,16.64 25.53,22.35 26.85,23.67 BZ1.+ | IC4.20 21.49,33.63 v21.34,33.78
  Top 0.813: IC2.TAB 6.26,30.57 7.62,30.57 8.34,30.57 v8.38,30.61
  Bottom 0.305: R9.2 27.18,4.19 26.67,3.68 24.59,3.68 J6.1 | R8.2 32.64,4.45 31.88,3.68 30.05,3.68 | 30.05,3.68 J5.1 | R7.2 38.23,5.84 | 38.23,5.84 38.23,4.32 37.62,3.71 J4.1 | v56.39,4.19 55.88,4.7 v53.98,4.7 | v41.4,4.7 39.37,4.7 38.23,5.84 | v25.53,16.64 27.69,16.64 28.96,15.37 v28.96,11.94 | v27.94,9.27 28.07,9.27 28.7,8.64 28.7,4.19 29.21,3.68 30.05,3.68
  Bottom 0.61: 15.24,19.05 19.3,19.05 19.94,18.41 C3.1 25.4,16.76 v25.53,16.64 | 15.24,19.05 14.61,19.05 | 14.61,19.05 13.84,19.05 | 13.84,19.05 13.21,19.05 | 13.21,19.05 12.7,19.05 | 12.7,19.05 8.13,19.05 7.11,20.07 C2.A | v13.97,16.76 13.97,17.78 | 13.97,18.41 13.97,18.92 13.84,19.05 | 13.97,18.29 13.97,18.41 | 13.97,18.41 14.61,19.05 | 13.97,17.78 13.97,18.29 | 13.97,18.29 13.21,19.05 | 15.24,19.05 13.97,17.78 | 13.97,17.78 12.7,19.05 | v21.34,33.78 21.08,34.04 11.81,34.04 v8.38,30.61
  Bottom 0.813: C2.A 7.11,24.64 6.48,25.27 C1.1 5.85,29.22 7.24,30.61 v8.38,30.61
  other vias: 6.35,31.75 6.35,30.48 7.62,30.48
VS
  Top 0.61: IC4.10 12.16,21.21 10.67,21.21
  Top 0.813: U$3.TIP 11.96,18.27 | 11.96,18.27 C9.1 | J15.2 5.19,21.1 IC2.2 9.42,21.21 10.67,21.21 11.56,21.21 11.96,20.81 11.96,18.27
(copper drawn outside any net)
  shapes: Bottom area x1, Top area x2

### Text on the board
Bottom: Design by Prakit Junkhum
tNames: 6-9 VDC | 3V G S x 1 / 5V G S x 3 | TX RX 5V GND